# EAGLE design main-v1.0 (EAGLE 7.7.0)
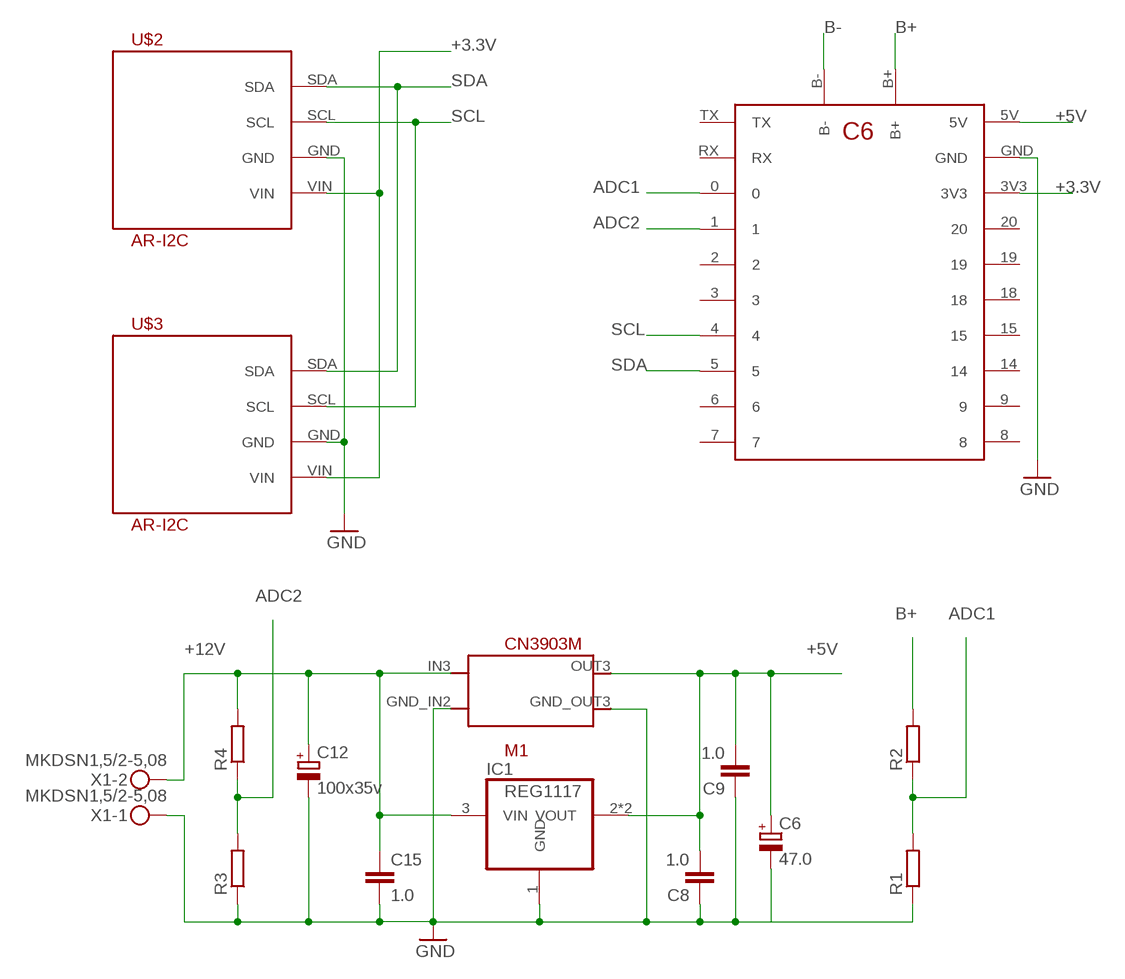
[diagram p0: schematic, sheet 1]

## Parts
C6  47.0  CPOL-EUSMCB  [SMC_B]
C8  1.0  C-EUC0805  [C0805]
C9  1.0  C-EUC0805  [C0805]
C12  100x35v  CPOL-EUSMCE  [SMC_E]
C15  1.0  C-EUC1206  [C1206]
IC1  REG1117  [SOT223]
M1  CN3903M  [CN3903M]
R1  R-EU_R0603  [R0603]
R2  R-EU_R0603  [R0603]
R3  R-EU_R0603  [R0603]
R4  R-EU_R0603  [R0603]
U$1  ESP32-C6-SM  [ESP32-C6-SUPER-MINI]
U$2  AR-I2C  [AR-I2C]
U$3  AR-I2C  [AR-I2C]
X1  MKDSN1,5/2-5,08  [MKDSN1,5/2-5,08]

## Nets
+3.3V: U$1.3V3 U$2.VIN U$3.VIN
+5V: C6.+ C8.2 C9.2 IC1.2(VOUT) IC1.4(VOUT) M1.OUT3(OUT) U$1.5V
+12V: C12.+ C15.1 IC1.3(VIN) M1.IN3(IN) R4.2 X1.2
ADC1: R1.2 R2.1 U$1.0
ADC2: R3.2 R4.1 U$1.1
B+: R2.2 U$1.B+
B-: U$1.B-
GND [POWER]: C6.- C8.1 C9.1 C12.- C15.2 IC1.1(GND) M1.GND_IN2(GND_IN) M1.GND_OUT3(GND_OUT) R1.1 R3.1 U$1.GND U$2.GND U$3.GND X1.1
SCL: U$1.4 U$2.SCL U$3.SCL
SDA: U$1.5 U$2.SDA U$3.SDA
Unconnected: U$1.2 U$1.3 U$1.6 U$1.7 U$1.8 U$1.9 U$1.14 U$1.15 U$1.18 U$1.19 U$1.20 U$1.RX U$1.TX

## Library data of the parts
C6 C12 = rcl:CPOL-EU: POLARIZED CAPACITOR, European symbol
C8 C9 C15 = rcl:C-EU: CAPACITOR, European symbol
IC1 = burr-brown:REG1117: 800mA and 1A Low Dropout (LDO) Positive Regulator 1.8V, 2.5V, 2.85V, 3.3V, 5V, and Adj; MPN: REG1117; OC_FARNELL: 1097566; OC_NEWARK: 14P6981
M1 = relay-quad-1.0:CN3903
R1-R4 = rcl:R-EU_: RESISTOR, European symbol
U$1 = ESP32C3supermini:ESP32-C6-SM
U$2 U$3 = ESP32C3supermini:AR-I2C
X1 = con-phoenix-508:MKDSN1,5/2-5,08: MKDSN 1,5/ 2-5,08 Printklemme Nennstrom: 13,5 A Nennspannung: 250 V Rastermaß: 5,08 mm Polzahl: 2 Anschlussart: Schraubanschluss Montage: Löten Anschlussrichtung Leiter/Platine: 0 ° Artikelnummer: 1729128 Source: http://eshop.phoenixcontact.com .. 1729128.pdf

## Net classes
1 POWER: width 0.508 mm, clearance 0.254 mm

## Board
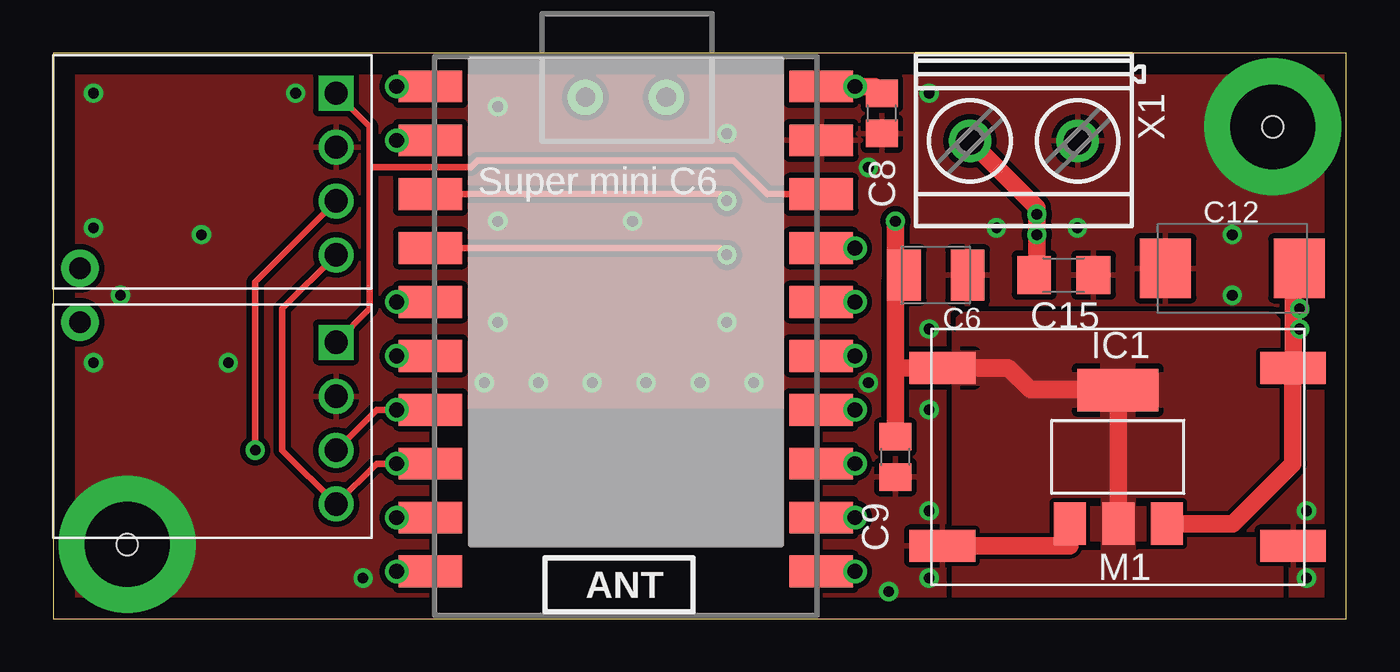
[diagram p1: board, top side]
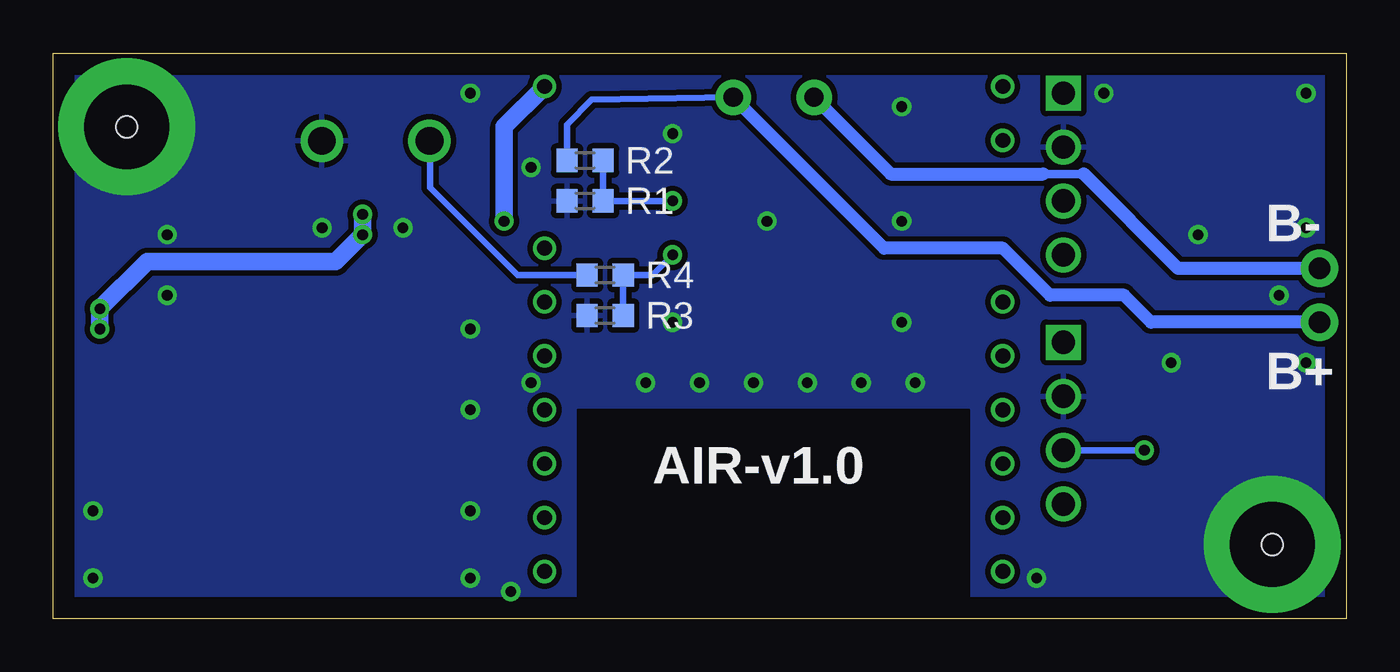
[diagram p2: board, bottom side, seen from below]

Size 60.94 x 26.66 mm. Coordinates in mm from the lower left corner, seen from the top.
Outline: 0,0 60.94,0 60.94,26.66 0,26.66 0,0
Copper layers (1*16): Top 0.035mm / dielectric 1.5mm / Bottom 0.035mm
Design rules "default *": minimum track width 10mil, minimum drill 24mil, track to track 8mil, track to pad 8mil, pad to pad 8mil, via to via 8mil, smd to smd 8mil, copper to edge 40mil, drill to drill 8mil, minimum pad ring 10mil, minimum via ring 8mil, stop-mask expansion 4mil, vias tented up to drill 20mil, thermal gap 10mil
Holes 1 mm at 3.49,3.49 57.47,23.18

### Footprints (pad centres in the part's own frame; a part is rotated, then mirrored left to right if it is on the bottom)
SMC_B = smd 1.6 x 2.4: + -1.5,0; - 1.5,0
C0805 = smd 1.3 x 1.5: 1 -0.95,0; 2 0.95,0
SMC_E = smd 2.4 x 2.8: + -3.15,0; - 3.15,0
C1206 = smd 1.6 x 1.8: 1 -1.4,0; 2 1.4,0
SOT223 = smd 1.499 x 2.007: 1 -2.261,-3.15; 2 0.025,-3.15; 3 2.311,-3.15 | smd 3.81 x 2.007: 4 0,3.15
CN3903M = smd 3.1 x 1.5: GND_IN2 -8.26,4.19; GND_OUT3 8.26,4.19; IN3 -8.26,-4.19; OUT3 8.26,-4.19
R0603 = smd 1 x 1.1: 1 -0.85,0; 2 0.85,0
ESP32-C6-SUPER-MINI = smd 3 x 1.5: 0 -9.207,6.35; 1 -9.207,3.81; 2 -9.207,1.27; 3 -9.207,-1.27; 3V3 9.207,6.35; 4 -9.207,-3.81; 5 -9.207,-6.35; 5V 9.207,11.43; 6 -9.207,-8.89; 7 -9.207,-11.43; 8 9.207,-11.43; 9 9.207,-8.89; 14 9.207,-6.35; 15 9.207,-3.81; 18 9.207,-1.27; 19 9.207,1.27; 20 9.207,3.81; GND 9.207,8.89; RX -9.207,8.89; TX -9.207,11.43 | drill 0.9 pad 1.676: B+ 1.905,10.922; B- -1.905,10.922
AR-I2C = drill 1.1: GND 6.35,1.27; SCL 6.35,-1.27; SDA 6.35,-3.81 | drill 1.1 square: VIN 6.35,3.81
MKDSN1,5/2-5,08 = drill 1.3 pad 2: 1 -2.561,0.025; 2 2.519,0.025

### Placement (x,y rotation side)
C6  41.59,16.19 0 top
C8  39.05,23.81 90 top
C9  39.69,7.62 90 top
C12  55.56,16.51 180 top
C15  47.62,16.19 0 top
IC1  50.16,7.62 0 top
M1  50.16,7.62 180 top
R1  35.88,19.68 0 bottom
R2  35.88,21.59 180 bottom
R3  34.92,14.29 0 bottom
R4  34.92,16.19 180 bottom
U$1  26.99,13.65 0 top
U$2  6.99,9.21 0 top
U$3  6.99,20.95 0 top
X1  45.72,22.54 180 top

### Tracks (layer width: path | path; a pad name or v marks a point on that pad's centre or on a via)
+3.3V
  Top 0.305: U$1.3V3 33.66,20 32.07,21.59 20,21.59 19.68,21.27 14.92,21.27 | U$2.VIN 14.92,14.61 14.92,21.27 | 14.92,21.27 14.92,23.18 U$3.VIN
+5V  (via drill 0.5, 0.7)
  Top 0.813: C9.2 39.69,11.75 | 39.69,11.75 39.69,15.79 39.73,15.83 | 39.73,15.83 C6.+ | U$1.5V v37.78,25.08 38.73,25.08 C8.2 | 39.69,11.75 39.75,11.81 M1.OUT3 45.02,11.81 46.04,10.79 50.14,10.79 IC1.4 50.19,10.74 IC1.2 | v39.69,18.73 39.69,15.88 39.73,15.83
  Bottom 0.813: v39.69,18.73 39.69,23.18 v37.78,25.08
  pour Top: 43.18,0.95 43.18,13.65 57.15,13.65 57.15,0.95
+12V  (via drill 0.5)
  Top 0.813: 58.71,11.81 M1.IN3 | X1.2 46.35,19.36 v46.35,19.05 v46.35,18.1 46.35,16.32 C15.1 | IC1.3 55.59,4.47 58.42,7.3 M1.IN3 | C12.+ 58.42,16.22 58.42,14.61 | 58.42,14.61 M1.IN3 | v58.74,14.61 58.42,14.61
  Bottom 0.305: X1.2 43.18,22.5 43.18,20.32 39.05,16.19 R4.2
  Bottom 0.813: v46.35,19.05 v46.35,18.1 47.62,16.83 56.52,16.83 v58.74,14.61 v58.74,13.65
ADC1  (via drill 0.5)
  Top 0.305: U$1.0 31.43,20 v31.75,19.68
  Bottom 0.305: R2.1 R1.2 v31.75,19.68
ADC2  (via drill 0.5)
  Top 0.305: U$1.1 31.43,17.46 v31.75,17.14
  Bottom 0.305: R3.2 R4.1 32.7,16.19 v31.75,17.14
B+  (via drill 1 pad 1.78)
  Bottom 0.305: R2.2 36.73,23.28 35.56,24.45 U$1.B+
  Bottom 0.61: v1.27,13.97 9.21,13.97 10.48,15.24 13.97,15.24 16.19,17.46 21.78,17.46 U$1.B+
B-  (via drill 1 pad 1.78)
  Bottom 0.406: 12.38,20.95 14.29,20.95
  Bottom 0.61: v1.27,16.51 7.94,16.51 12.38,20.95 | 14.29,20.95 21.46,20.95 U$1.B-
GND  (via drill 0.5, 4 pad 6.45)
  Top 0.813: M1.GND_OUT3 47.9,3.43 IC1.1
  other vias: 3.49,3.49 57.47,23.18 59.05,1.91 59.05,5.08 41.27,1.91 41.27,5.08 38.42,11.11 44.45,18.41 48.26,18.41 41.27,24.77 20.95,18.73 27.3,18.73 20.95,24.13 20.95,13.97 31.75,13.97 20.32,11.11 22.86,11.11 25.4,11.11 27.94,11.11 30.48,11.11 33.02,11.11 14.61,1.91 39.37,1.27 8.26,12.06 6.99,18.1 1.91,24.77 1.91,12.06 1.91,18.41 11.43,24.77 31.75,22.86 38.42,21.27 41.27,13.65 55.56,15.24 55.56,18.1 41.27,9.84 3.17,15.24
  pour Top (rank 2): 0.32,26.35 0.32,0.32 60.64,0.32 60.64,26.35
  pour Bottom: 0.32,26.35 0.32,0.32 60.64,0.32 60.64,26.35
N$1
  cutout Top: 17.78,0.32 17.78,9.84 36.2,9.84 36.2,0.32
N$2
  cutout Bottom: 17.78,0.32 17.78,9.84 36.2,9.84 36.2,0.32
N$3  (via drill 0.7)
  other vias: 16.19,22.54
N$4  (via drill 0.7)
  other vias: 16.19,25.08
N$5  (via drill 0.7)
  other vias: 16.19,14.92
N$6  (via drill 0.7)
  other vias: 16.19,12.38
N$7  (via drill 0.7)
  other vias: 16.19,4.76
N$8  (via drill 0.7)
  other vias: 16.19,2.22
N$9  (via drill 0.7)
  other vias: 37.78,17.46
N$10  (via drill 0.7)
  other vias: 37.78,14.92
N$11  (via drill 0.7)
  other vias: 37.78,12.38
N$12  (via drill 0.7)
  other vias: 37.78,9.84
N$13  (via drill 0.7)
  other vias: 37.78,7.3
N$14  (via drill 0.7)
  other vias: 37.78,4.76
N$15  (via drill 0.7)
  other vias: 37.78,2.22
SCL  (via drill 0.5, 0.7)
  Top 0.305: U$1.4 v16.19,9.84 15.24,9.84 U$2.SCL | U$3.SCL 9.53,15.88 v9.53,7.94
  Bottom 0.305: v9.53,7.94 U$2.SCL
SDA  (via drill 0.7)
  Top 0.305: U$1.5 v16.19,7.3 15.24,7.3 U$2.SDA 10.79,7.94 10.79,14.61 U$3.SDA

### Text on the board
bNames: B- | B+ | AIR-v1.0